# Altium project XC7Z010 Test B'd (Rev.A).PrjPcb
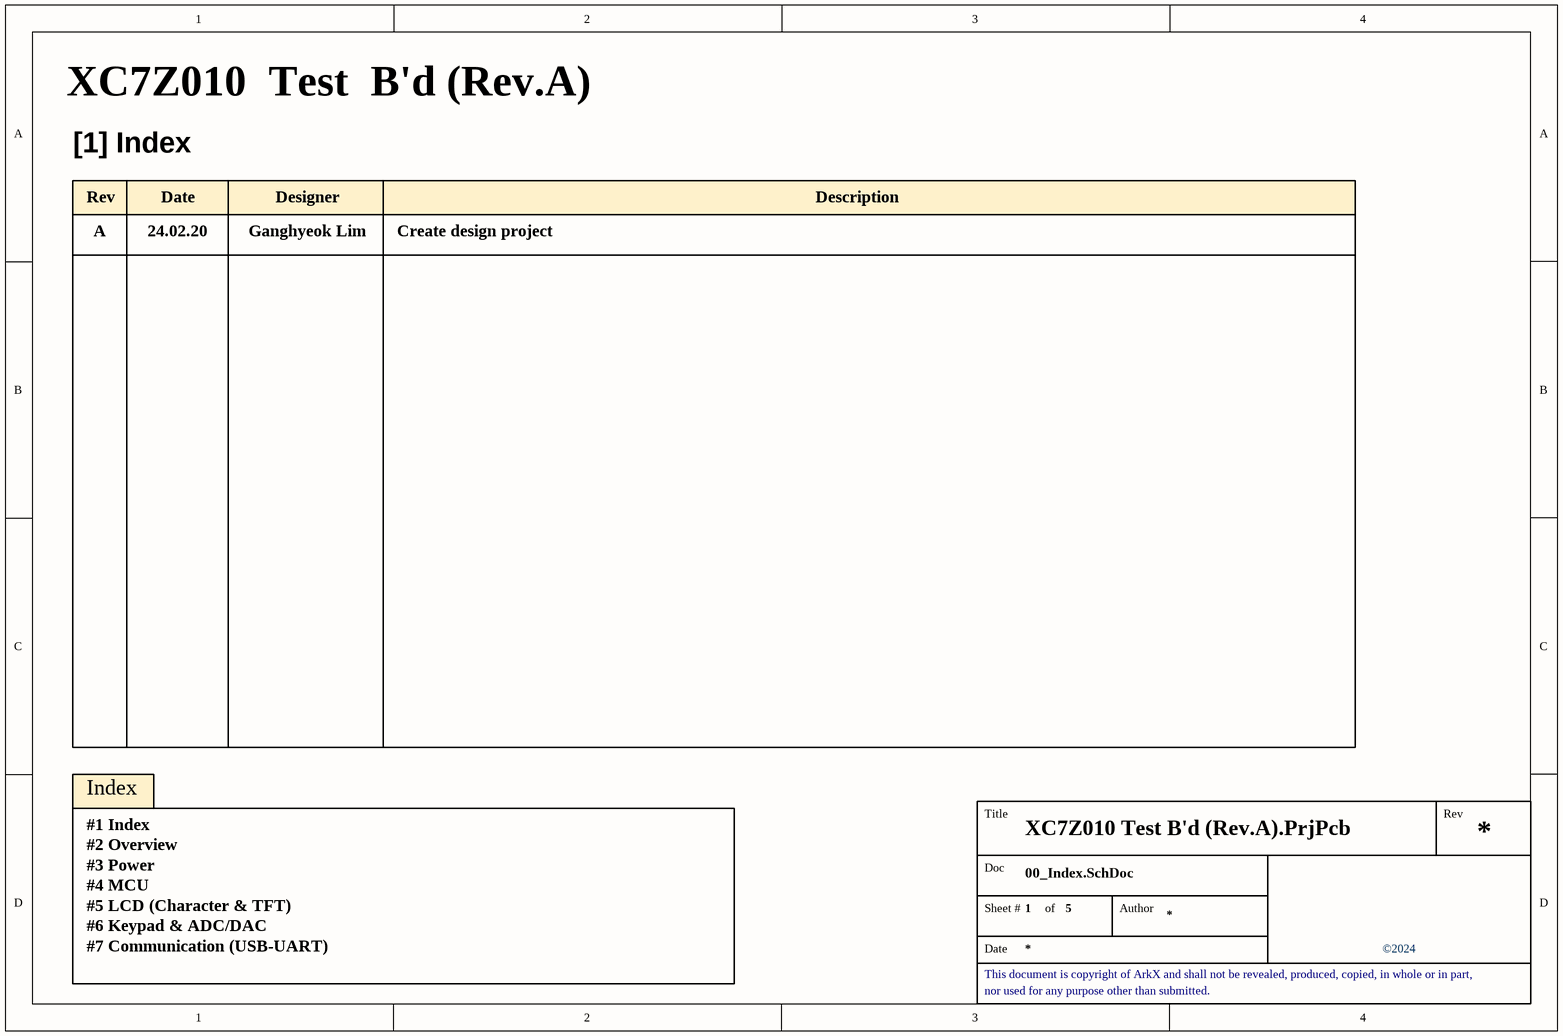
[diagram p0: 00_Index.SchDoc]
5 sheets, 73 parts. Net scope: global (net labels, ports and power ports of the same name join across sheets).
Sheets:
  00_Index.SchDoc
  01_Overview.SchDoc
  02_Power_Budget.SchDoc
  03_Power.SchDoc
  04_Zynq_Power.SchDoc

## Sheet 00_Index.SchDoc
size A4; SheetNumber: 1; SheetTotal: 5

### Notes on the sheet
- XC7Z010  Test  B'd (Rev.A)
- [1] Index
- Rev
- A
- 24.02.20
- Date
- Ganghyeok Lim
- Designer
- Create design project
- Description
- Index
- #1 Index
- #2 Overview
- #3 Power
- #4 MCU
- #5 LCD (Character & TFT)
- #6 Keypad & ADC/DAC
- #7 Communication (USB-UART)
- Title
- Doc
- Sheet #
- of
- Author
- This document is copyright of ArkX and shall not be revealed, produced, copied, in whole or in part,
- ©2024
- nor used for any purpose other than submitted.

## Sheet 01_Overview.SchDoc
size A4; SheetNumber: 2; SheetTotal: 5
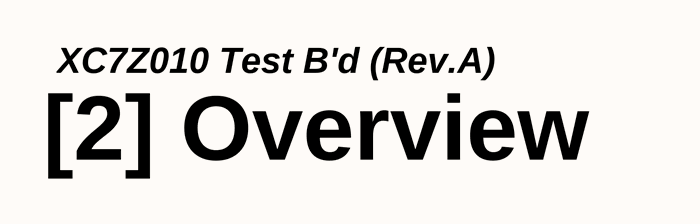
[diagram p1: 01_Overview.SchDoc]

### Notes on the sheet
- [2] Overview
- XC7Z010 Test B'd (Rev.A)

## Sheet 02_Power_Budget.SchDoc
size A4; SheetNumber: 3; SheetTotal: 5
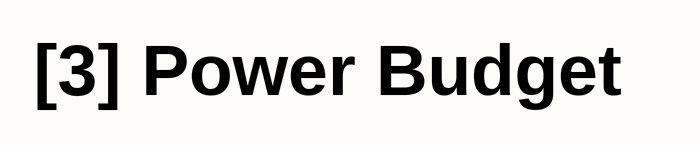
[diagram p2: 02_Power_Budget.SchDoc]

### Notes on the sheet
- [3] Power Budget

## Sheet 03_Power.SchDoc
size A3; SheetNumber: 4; SheetTotal: 6
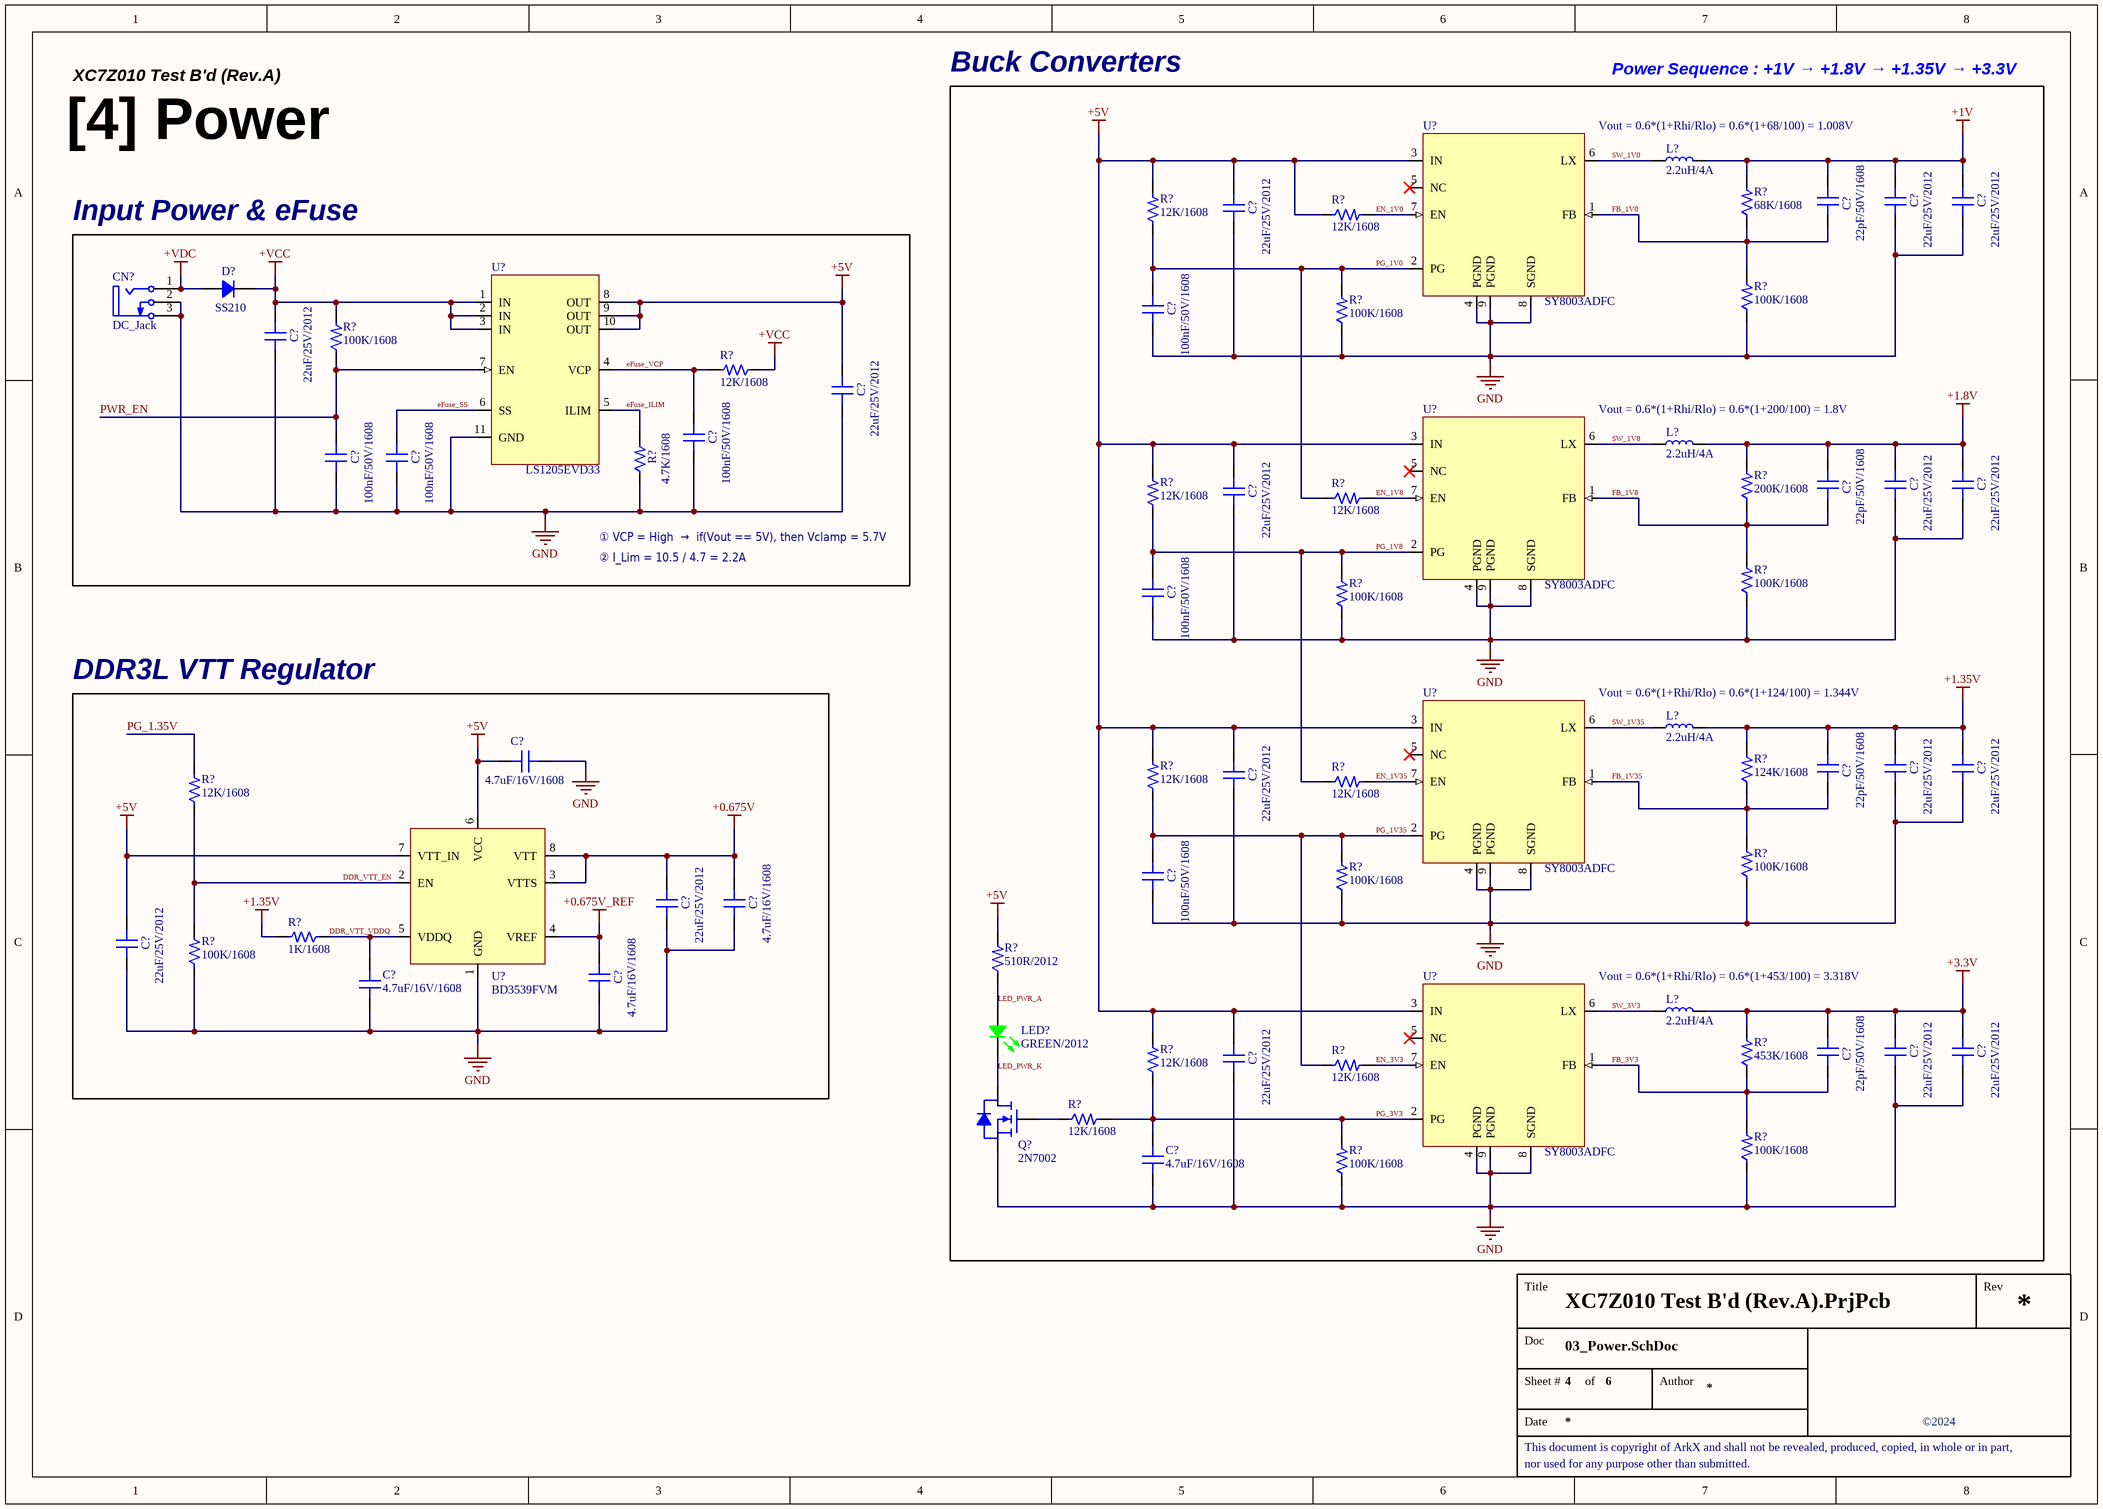
[diagram p3: 03_Power.SchDoc]

### Parts
(Parts that share a designator on the sheet are numbered #1, #2 ... from top to bottom, then left to right.)
C?#1  22pF/50V/1608  [CAP 1608 (0603_INCH)]
C?#2  22uF/25V/2012  [CAP 2012 (0805_INCH)]
C?#3  22uF/25V/2012  [CAP 2012 (0805_INCH)]
C?#4  22uF/25V/2012  [CAP 2012 (0805_INCH)]
C?#5  100nF/50V/1608  [CAP 1608 (0603_INCH)]
C?#6  22uF/25V/2012  [CAP 2012 (0805_INCH)]
C?#7  22uF/25V/2012  [CAP 2012 (0805_INCH)]
C?#8  100nF/50V/1608  [CAP 1608 (0603_INCH)]
C?#9  100nF/50V/1608  [CAP 1608 (0603_INCH)]
C?#10  100nF/50V/1608  [CAP 1608 (0603_INCH)]
C?#11  22pF/50V/1608  [CAP 1608 (0603_INCH)]
C?#12  22uF/25V/2012  [CAP 2012 (0805_INCH)]
C?#13  22uF/25V/2012  [CAP 2012 (0805_INCH)]
C?#14  22uF/25V/2012  [CAP 2012 (0805_INCH)]
C?#15  100nF/50V/1608  [CAP 1608 (0603_INCH)]
C?#16  4.7uF/16V/1608  [CAP 1608 (0603_INCH)]
C?#17  22pF/50V/1608  [CAP 1608 (0603_INCH)]
C?#18  22uF/25V/2012  [CAP 2012 (0805_INCH)]
C?#19  22uF/25V/2012  [CAP 2012 (0805_INCH)]
C?#20  22uF/25V/2012  [CAP 2012 (0805_INCH)]
C?#21  100nF/50V/1608  [CAP 1608 (0603_INCH)]
C?#22  22uF/25V/2012  [CAP 2012 (0805_INCH)]
C?#23  4.7uF/16V/1608  [CAP 1608 (0603_INCH)]
C?#24  22uF/25V/2012  [CAP 2012 (0805_INCH)]
C?#25  4.7uF/16V/1608  [CAP 1608 (0603_INCH)]
C?#26  4.7uF/16V/1608  [CAP 1608 (0603_INCH)]
C?#27  22pF/50V/1608  [CAP 1608 (0603_INCH)]
C?#28  22uF/25V/2012  [CAP 2012 (0805_INCH)]
C?#29  22uF/25V/2012  [CAP 2012 (0805_INCH)]
C?#30  22uF/25V/2012  [CAP 2012 (0805_INCH)]
C?#31  4.7uF/16V/1608  [CAP 1608 (0603_INCH)]
CN?  DC_Jack  [CON DC-Jack]
D?  SS210  [DIO DO-214AC (SMA)]
L?#1  2.2uH/4A  [IND BWVS006060282R2M00]
L?#2  2.2uH/4A  [IND BWVS006060282R2M00]
L?#3  2.2uH/4A  [IND BWVS006060282R2M00]
L?#4  2.2uH/4A  [IND BWVS006060282R2M00]
LED?  GREEN/2012  [LED MHT170RGBCT (GREEN)]
Q?  2N7002  [SOT 23-3 (DIODES INCORPORATED)]
R?#1  68K/1608  [RES 1608 (0603_inch)]
R?#2  12K/1608  [RES 1608 (0603_inch)]
R?#3  12K/1608  [RES 1608 (0603_inch)]
R?#4  100K/1608  [RES 1608 (0603_inch)]
R?#5  100K/1608  [RES 1608 (0603_inch)]
R?#6  100K/1608  [RES 1608 (0603_inch)]
R?#7  12K/1608  [RES 1608 (0603_inch)]
R?#8  4.7K/1608  [RES 1608 (0603_inch)]
R?#9  200K/1608  [RES 1608 (0603_inch)]
R?#10  12K/1608  [RES 1608 (0603_inch)]
R?#11  12K/1608  [RES 1608 (0603_inch)]
R?#12  100K/1608  [RES 1608 (0603_inch)]
R?#13  100K/1608  [RES 1608 (0603_inch)]
R?#14  124K/1608  [RES 1608 (0603_inch)]
R?#15  12K/1608  [RES 1608 (0603_inch)]
R?#16  12K/1608  [RES 1608 (0603_inch)]
R?#17  12K/1608  [RES 1608 (0603_inch)]
R?#18  100K/1608  [RES 1608 (0603_inch)]
R?#19  100K/1608  [RES 1608 (0603_inch)]
R?#20  1K/1608  [RES 1608 (0603_inch)]
R?#21  100K/1608  [RES 1608 (0603_inch)]
R?#22  510R/2012  [RES 2012 (0805_inch)]
R?#23  453K/1608  [RES 1608 (0603_inch)]
R?#24  12K/1608  [RES 1608 (0603_inch)]
R?#25  12K/1608  [RES 1608 (0603_inch)]
R?#26  12K/1608  [RES 1608 (0603_inch)]
R?#27  100K/1608  [RES 1608 (0603_inch)]
R?#28  100K/1608  [RES 1608 (0603_inch)]
U?#1  SY8003ADFC  [DFN2x2-8]
U?#2  LS1205EVD33
U?#3  SY8003ADFC  [DFN2x2-8]
U?#4  SY8003ADFC  [DFN2x2-8]
U?#5  BD3539FVM
U?#6  SY8003ADFC  [DFN2x2-8]

### Blocks framed on the sheet
Buck Converters: C?#1-C?#5 C?#11-C?#15 C?#17-C?#21 C?#27-C?#31 L?#1-L?#4 LED? Q? R?#1-R?#5 R?#9-R?#16 R?#18 R?#19 R?#22-R?#28 U?#1 U?#3 U?#4 U?#6
Input Power & eFuse: C?#6-C?#10 CN? D? R?#6-R?#8 U?#2
DDR3L VTT Regulator: C?#16 C?#22-C?#26 R?#17 R?#20 R?#21 U?#5

### Nets
+0.675V: C?#22.2 C?#23.2 U?#5.3(VTTS) U?#5.8(VTT)
+0.675V_REF: C?#25.2 U?#5.4(VREF)
+1.8V: C?#11.2 C?#12.2 C?#13.2 L?#2.2 R?#9.2
+1.35V: C?#17.2 C?#18.2 C?#19.2 L?#3.2 R?#14.2 R?#20.2
+1V: C?#1.2 C?#2.2 C?#3.2 L?#1.2 R?#1.2
+3.3V: C?#27.2 C?#28.2 C?#29.2 L?#4.2 R?#23.2
+5V: C?#4.2 C?#7.2 C?#14.2 C?#16.2 C?#20.2 C?#24.2 C?#30.2 R?#2.2 R?#3.1 R?#10.2 R?#15.2 R?#22.2 R?#24.2 U?#1.3(IN) U?#2.8(OUT) U?#2.9(OUT) U?#2.10(OUT) U?#3.3(IN) U?#4.3(IN) U?#5.6(VCC) U?#5.7(VTT_IN) U?#6.3(IN)
+VCC: C?#6.2 D?.2 R?#6.2 R?#7.1 U?#2.1(IN) U?#2.2(IN) U?#2.3(IN)
+VDC: CN?.1(VCC) D?.1
GND: C?#2.1 C?#3.1 C?#4.1 C?#5.1 C?#6.1 C?#7.1 C?#8.1 C?#9.1 C?#10.1 C?#12.1 C?#13.1 C?#14.1 C?#15.1 C?#16.1 C?#18.1 C?#19.1 C?#20.1 C?#21.1 C?#22.1 C?#23.1 C?#24.1 C?#25.1 C?#26.1 C?#28.1 C?#29.1 C?#30.1 C?#31.1 CN?.2(GND) CN?.3(GND) Q?.2(S) R?#4.1 R?#5.1 R?#8.1 R?#12.1 R?#13.1 R?#18.1 R?#19.1 R?#21.1 R?#27.1 R?#28.1 U?#1.4(PGND) U?#1.8(SGND) U?#1.9(PGND) U?#2.11(GND) U?#3.4(PGND) U?#3.8(SGND) U?#3.9(PGND) U?#4.4(PGND) U?#4.8(SGND) U?#4.9(PGND) U?#5.1(GND) U?#6.4(PGND) U?#6.8(SGND) U?#6.9(PGND)
DDR_VTT_EN: R?#17.1 R?#21.2 U?#5.2(EN)
DDR_VTT_VDDQ: C?#26.2 R?#20.1 U?#5.5(VDDQ)
eFuse_ILIM: R?#8.2 U?#2.5(ILIM)
eFuse_SS: C?#10.2 U?#2.6(SS)
eFuse_VCP: C?#8.2 R?#7.2 U?#2.4(VCP)
EN_1V0: R?#3.2 U?#1.7(EN)
EN_1V8: R?#11.2 U?#3.7(EN)
EN_1V35: R?#16.2 U?#4.7(EN)
EN_3V3: R?#25.2 U?#6.7(EN)
FB_1V0: C?#1.1 R?#1.1 R?#4.2 U?#1.1(FB)
FB_1V8: C?#11.1 R?#9.1 R?#12.2 U?#3.1(FB)
FB_1V35: C?#17.1 R?#14.1 R?#18.2 U?#4.1(FB)
FB_3V3: C?#27.1 R?#23.1 R?#27.2 U?#6.1(FB)
LED_PWR_A: LED?.4(Common_Anode) R?#22.1
LED_PWR_K: LED?.2(GREEN) Q?.3(D)
PG_1.35V: R?#17.2
PG_1V0: C?#5.2 R?#2.1 R?#5.2 R?#11.1 U?#1.2(PG)
PG_1V8: C?#15.2 R?#10.1 R?#13.2 R?#16.1 U?#3.2(PG)
PG_1V35: C?#21.2 R?#15.1 R?#19.2 R?#25.1 U?#4.2(PG)
PG_3V3: C?#31.2 R?#24.1 R?#26.2 R?#28.2 U?#6.2(PG)
PWR_EN: C?#9.2 R?#6.1 U?#2.7(EN)
SW_1V0: L?#1.1 U?#1.6(LX)
SW_1V8: L?#2.1 U?#3.6(LX)
SW_1V35: L?#3.1 U?#4.6(LX)
SW_3V3: L?#4.1 U?#6.6(LX)
NetQ?_1: Q?.1(G) R?#26.1

Not connected (* = marked no-connect by the designer): U?#1 5(NC)*; U?#3 5(NC)*; U?#4 5(NC)*; U?#6 5(NC)*

### Notes on the sheet
- XC7Z010 Test B'd (Rev.A)
- Power Sequence : +1V → +1.8V → +1.35V → +3.3V
- [4] Power
- Vout = 0.6*(1+Rhi/Rlo) = 0.6*(1+68/100) = 1.008V
- Vout = 0.6*(1+Rhi/Rlo) = 0.6*(1+200/100) = 1.8V
- ① VCP = High  →  if(Vout == 5V), then Vclamp = 5.7V
- ② I_Lim = 10.5 / 4.7 = 2.2A
- Vout = 0.6*(1+Rhi/Rlo) = 0.6*(1+124/100) = 1.344V
- Vout = 0.6*(1+Rhi/Rlo) = 0.6*(1+453/100) = 3.318V
- Title
- Rev
- Doc
- Sheet #
- of
- Author
- This document is copyright of ArkX and shall not be revealed, produced, copied, in whole or in part,
- Date
- ©2024
- nor used for any purpose other than submitted.

### Library data of the parts
C?#1 C?#11 C?#17 C?#27 = CAP_22pF/50V/1608: Ceramic CAP_22pF/50V/1608; LCSC Part #: C1653; JLCPCB Part Type: Basic Part
C?#2-C?#4 C?#6 C?#7 C?#12-C?#14 C?#18-C?#20 C?#22 C?#24 C?#28-C?#30 = CAP_22uF/25V/2012: Ceramic CAP_22uF/25V/2012; LCSC Part #: C45783; JLCPCB Part Type: Basic Part
C?#5 C?#8-C?#10 C?#15 C?#21 = CAP_100nF/50V/1608: Ceramic CAP_100nF/50V/1608; LCSC Part #: C14663; JLCPCB Part Type: Basic Part
C?#16 C?#23 C?#25 C?#26 C?#31 = CAP_4.7uF/16V/1608: Ceramic CAP_4.7uF/16V/1608; LCSC Part #: C19666; JLCPCB Part Type: Basic Part
CN? = CON_DC-Jack: ComponentLink1Description: Manufacturer Link; ComponentLink1URL: http://www.cliffuk.co.uk/
D? = DIO_SS210: 100V 850mV@2A 2A SMA(DO-214AC)  Schottky Barrier Diodes (SBD) ROHS; LCSC Part #: C14996; JLCPCB Part Type: Basic Part
L?#1-L?#4 = IND_BWVS006060282R2M00: FIXED IND 2.2uH 4A 20mohm SMD; Supplier 1: Digi-Key; Supplier 2: Mouser
LED? = LED_MHT170RGBCT(GREEN): Colorless transparence -30℃~+85℃ Positive post Common anode RGB 120° 0805  Light Emitting Diodes (LED) ROHS; LCSC Part #: C2962094; JLCPCB Part Type: Extended Part
Q? = FET_2N7002: 60V 115mA 200mW 7.5Ω@10V,500mA N Channel SOT-23  MOSFETs ROHS; LCSC Part #: C8545; JLCPCB Part Type: Basic Part
R?#1 = RES_68K/1608/0.1W: Value: 68K; Power Rating: 0.1W; Precision: 1%; Size: 1608; LCSC Part #: C23231; JLCPCB Part Type: Basic Part
R?#2 R?#3 R?#7 R?#10 R?#11 R?#15-R?#17 R?#24-R?#26 = RES_12K/1608/0.1W: Value: 12K; Power Rating: 0.1W; Precision: 1%; Size: 1608; LCSC Part #: C22790; JLCPCB Part Type: Basic Part
R?#4-R?#6 R?#12 R?#13 R?#18 R?#19 R?#21 R?#27 R?#28 = RES_100K/1608/0.1W: Value: 100K; Power Rating: 0.1W; Precision: 1%; Size: 1608; LCSC Part #: C25803; JLCPCB Part Type: Basic Part
R?#8 = RES_4.7K/1608/0.1W: Value: 4.7K; Power Rating: 0.1W; Precision: 1%; Size: 1608; LCSC Part #: C23162; JLCPCB Part Type: Basic Part
R?#9 = RES_200K/1608/0.1W: Value: 200K; Power Rating: 0.1W; Precision: 1%; Size: 1608; LCSC Part #: C25811; JLCPCB Part Type: Basic Part
R?#14 = RES_124K/1608/0.1W: Value: 124K; Power Rating: 0.1W; Precision: 1%; Size: 1608; LCSC Part #: C140118; JLCPCB Part Type: Extended Part
R?#20 = RES_1K/1608/0.1W: Value: 1K; Power Rating: 0.1W; Precision: 1%; Size: 1608; LCSC Part #: C21190; JLCPCB Part Type: Basic Part
R?#22 = RES_510R/2012/0.125W: Value: 510R; Power Rating: 0.125W; Precision: 1%; Size: 2012; LCSC Part #: C17734; JLCPCB Part Type: Basic Part
R?#23 = RES_453K/1608/0.1W: Value: 453K; Power Rating: 0.1W; Precision: 1%; Size: 1608; LCSC Part #: C25818; JLCPCB Part Type: Extended Part
U?#1 U?#3 U?#4 U?#6 = IC_REG_SY8003ADFC: High Efficiency 5.5V, 3A Continuous, 1MHz Synchronous Step Down Regulator; Manufacturer: Silergy; Manufacturer Part Number: High Efficiency 5.5V, 3A continuous, 1MHz; LCSC: C178236
U?#2 = IC_eFUSE_LS1205EVD33: 18V, 5A eFuse with Programmable Current Limit and Output Voltage Clamp, 10-DFN (3x3)
U?#5 = IC_REG_VTT_BD3539FVM: 1.0V to 5.5V, 1A 1ch / Termination Regulators for DDR-SDRAMs, 8-MSOP

## Sheet 04_Zynq_Power.SchDoc
size A4; SheetNumber: 5; SheetTotal: 5